# Altium schematic sheet STLINK.SchDoc
size A4; Engineer: Csh; Address1: 巡游; project1: 巡游; project2: 最小系统; project3: 巡游; project4: 传感器
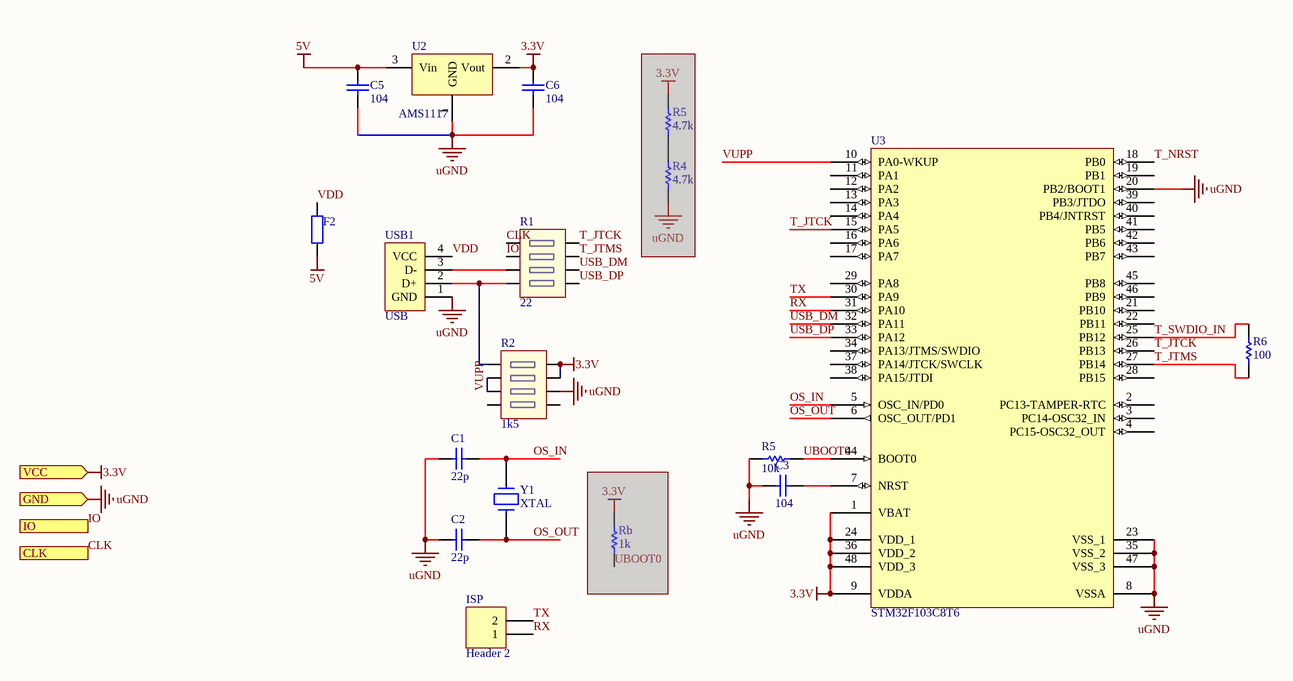
[diagram p0: STLINK.SchDoc]

## Parts
(Parts that share a designator on the sheet are numbered #1, #2 ... from top to bottom, then left to right.)
C1  value 22p  [0805_CAP]  (hidden comment: Cap)
C2  value 22p  [0805_CAP]  (hidden comment: Cap)
C3  value 104  [0805_CAP]  (hidden comment: Cap)
C5  value 104  [0805_CAP]  (hidden comment: Cap)
C6  value 104  [0805_CAP]  (hidden comment: Cap)
F2  Res2  [0805_RES]  (value not drawn)
ISP  Header 2  [HDR1X2]
R1  22  [0603_P]
R2  1k5  [0603_P]
R4  value 4.7k  [0603_RES]  (hidden comment: RES)  (masked out: inside a compile mask, not in the netlist)
R5#1  value 4.7k  [0603_RES]  (hidden comment: RES)  (masked out: inside a compile mask, not in the netlist)
R5#2  value 10k  [0805_RES]  (hidden comment: RES)
R6  value 100  [0805_RES]  (hidden comment: RES)
Rb  value 1k  [0805_RES]  (hidden comment: RES)  (masked out: inside a compile mask, not in the netlist)
U2  AMS1117  [SOT_223]
U3  STM32F103C8T6  [LQFP_48]
USB1  USB  [USB_B_M]
Y1  XTAL  [XTAL-RAD-0.2]

## Ports
CLK, GND, IO, VCC

## Nets
3.3V: C6.2 R2.7 R2.8 U2.2(Vout) U3.1(VBAT) U3.9(VDDA) U3.24(VDD_1) U3.36(VDD_2) U3.48(VDD_3) ; port VCC
5V: C5.2 F2.2 U2.3(Vin)
uGND: C1.1 C2.1 C3.1 C5.1 C6.1 R2.6 R5#2.1 U2.1(GND) U3.8(VSSA) U3.20(PB2/BOOT1) U3.23(VSS_1) U3.35(VSS_2) U3.47(VSS_3) USB1.1(GND) ; port GND
CLK: R1.1 ; port CLK
IO: R1.2 ; port IO
OS_IN: C1.2 U3.5(OSC_IN/PD0) Y1.2
OS_OUT: C2.2 U3.6(OSC_OUT/PD1) Y1.1
RX: ISP.1 U3.31(PA10)
T_JTCK: R1.8 U3.15(PA5) U3.26(PB13)
T_JTMS: R1.7 R6.1 U3.27(PB14)
T_NRST: U3.18(PB0)
T_SWDIO_IN: R6.2 U3.25(PB12)
TX: ISP.2 U3.30(PA9)
UBOOT0: R5#2.2 U3.44(BOOT0)
USB_DM: R1.6 U3.32(PA11)
USB_DP: R1.5 U3.33(PA12)
VDD: F2.1 USB1.4(VCC)
VUPP: R2.2 R2.3 U3.10(PA0-WKUP)
NetC3_2: C3.2 U3.7(NRST)
NetR1_3: R1.3 USB1.3(D-)
NetR1_4: R1.4 R2.1 USB1.2(D+)

Not connected (* = marked no-connect by the designer): R2 4 5; U3 2(PC13-TAMPER-RTC) 3(PC14-OSC32_IN) 4(PC15-OSC32_OUT) 11(PA1) 12(PA2) 13(PA3) 14(PA4) 16(PA6) 17(PA7) 19(PB1) 21(PB10) 22(PB11) 28(PB15) 29(PA8) 34(PA13/JTMS/SWDIO) 37(PA14/JTCK/SWCLK) 38(PA15/JTDI) 39(PB3/JTDO) 40(PB4/JNTRST) 41(PB5) 42(PB6) 43(PB7) 45(PB8) 46(PB9)

## Notes on the sheet
- Title：
- Date:
- Project：
- Remark：
- modified date：
- Drawn By:
- File：

## Library data of the parts
F2 = Res2: Resistor; Value: 1K; Published: 8-Jun-2000; LatestRevisionDate: 17-Jul-2002; LatestRevisionNote: Re-released for DXP Platform.; PackageReference: AXIAL-0.4; Publisher: Altium Limited
ISP = Header 2: Header, 2-Pin; LatestRevisionDate: 17-Jul-2002; LatestRevisionNote: Re-released for DXP Platform.; Publisher: Altium Limited
R1 R2 = 0603P
U2 = AMS1117: 3.3V电压转换器AMS1117
U3 = STM32F103C8T6: STM32 ARM-based 32-bit MCU with 64 Kbytes Flash, 48-pin LQFP, Industrial Temperature; Published: 30-May-2008; DatasheetVersion: rev6, Mar-2008; PackageVersion: Mar-2008; PackageReference: LQFP48; Publisher: Altium Limited; PackageDescription: 48-Pin Low-Profile Quad Flat Pack, 7 x 7 mm Body, 0.5 mm Pitch (LQFP48); ComponentLink1Description: Manufacturer Link; ComponentLink1URL: www.st.com/stm32; ComponentLink2Description: Datasheet; ComponentLink2URL: http://www.st.com/stonline/products/literature/ds/13587.pdf
USB1 = USB_G: pin to pad: 1>4 2>3 3>2 4>1